# EAGLE schematic Equalizer_VUMeter (EAGLE 9.6.2)
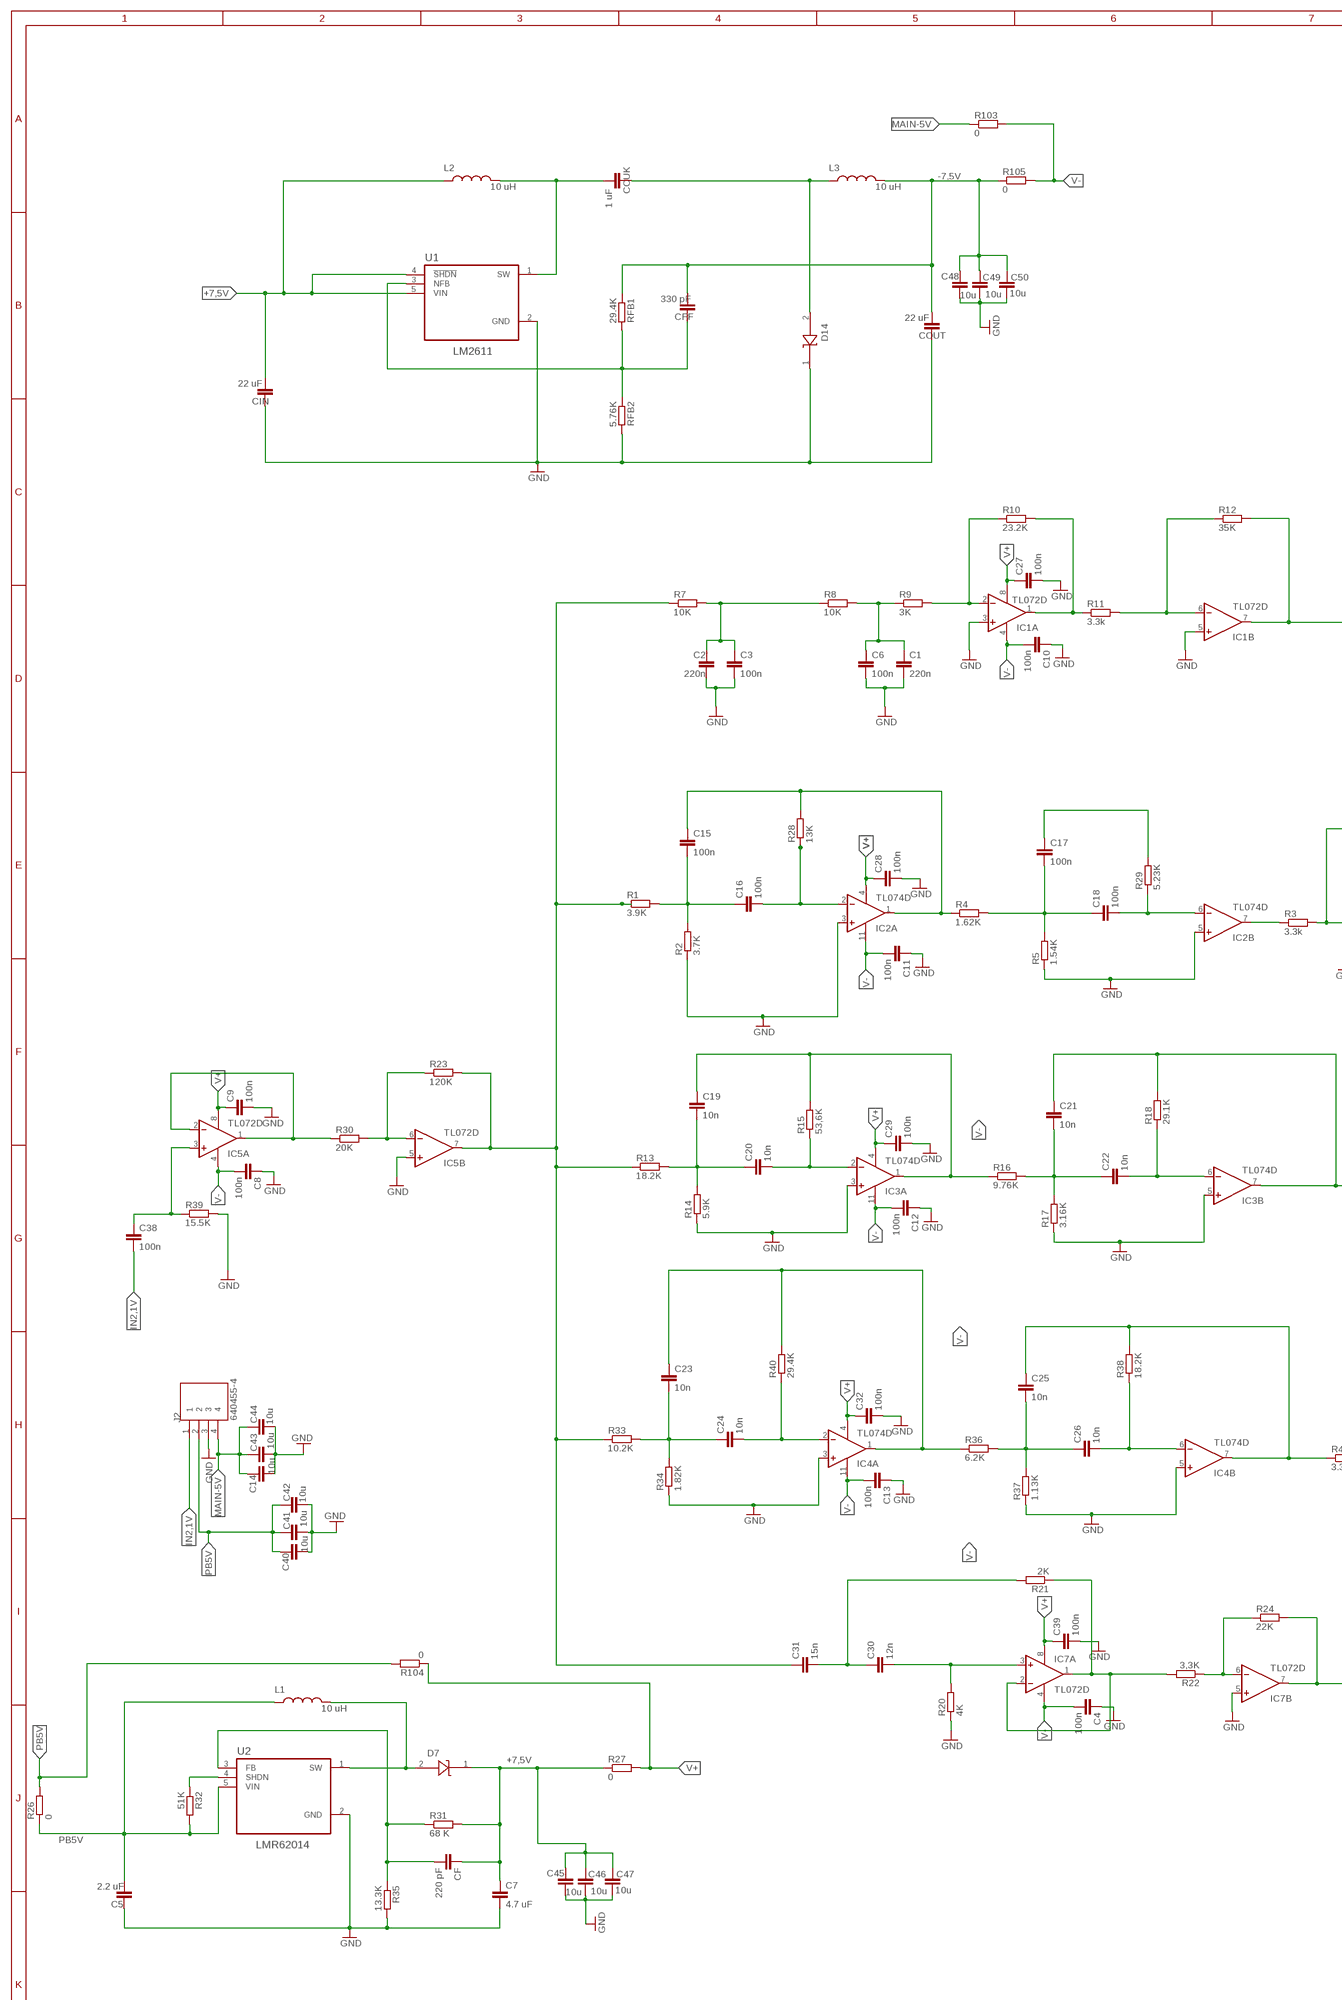
[diagram p0: schematic, sheet 1, part 1 of 3]
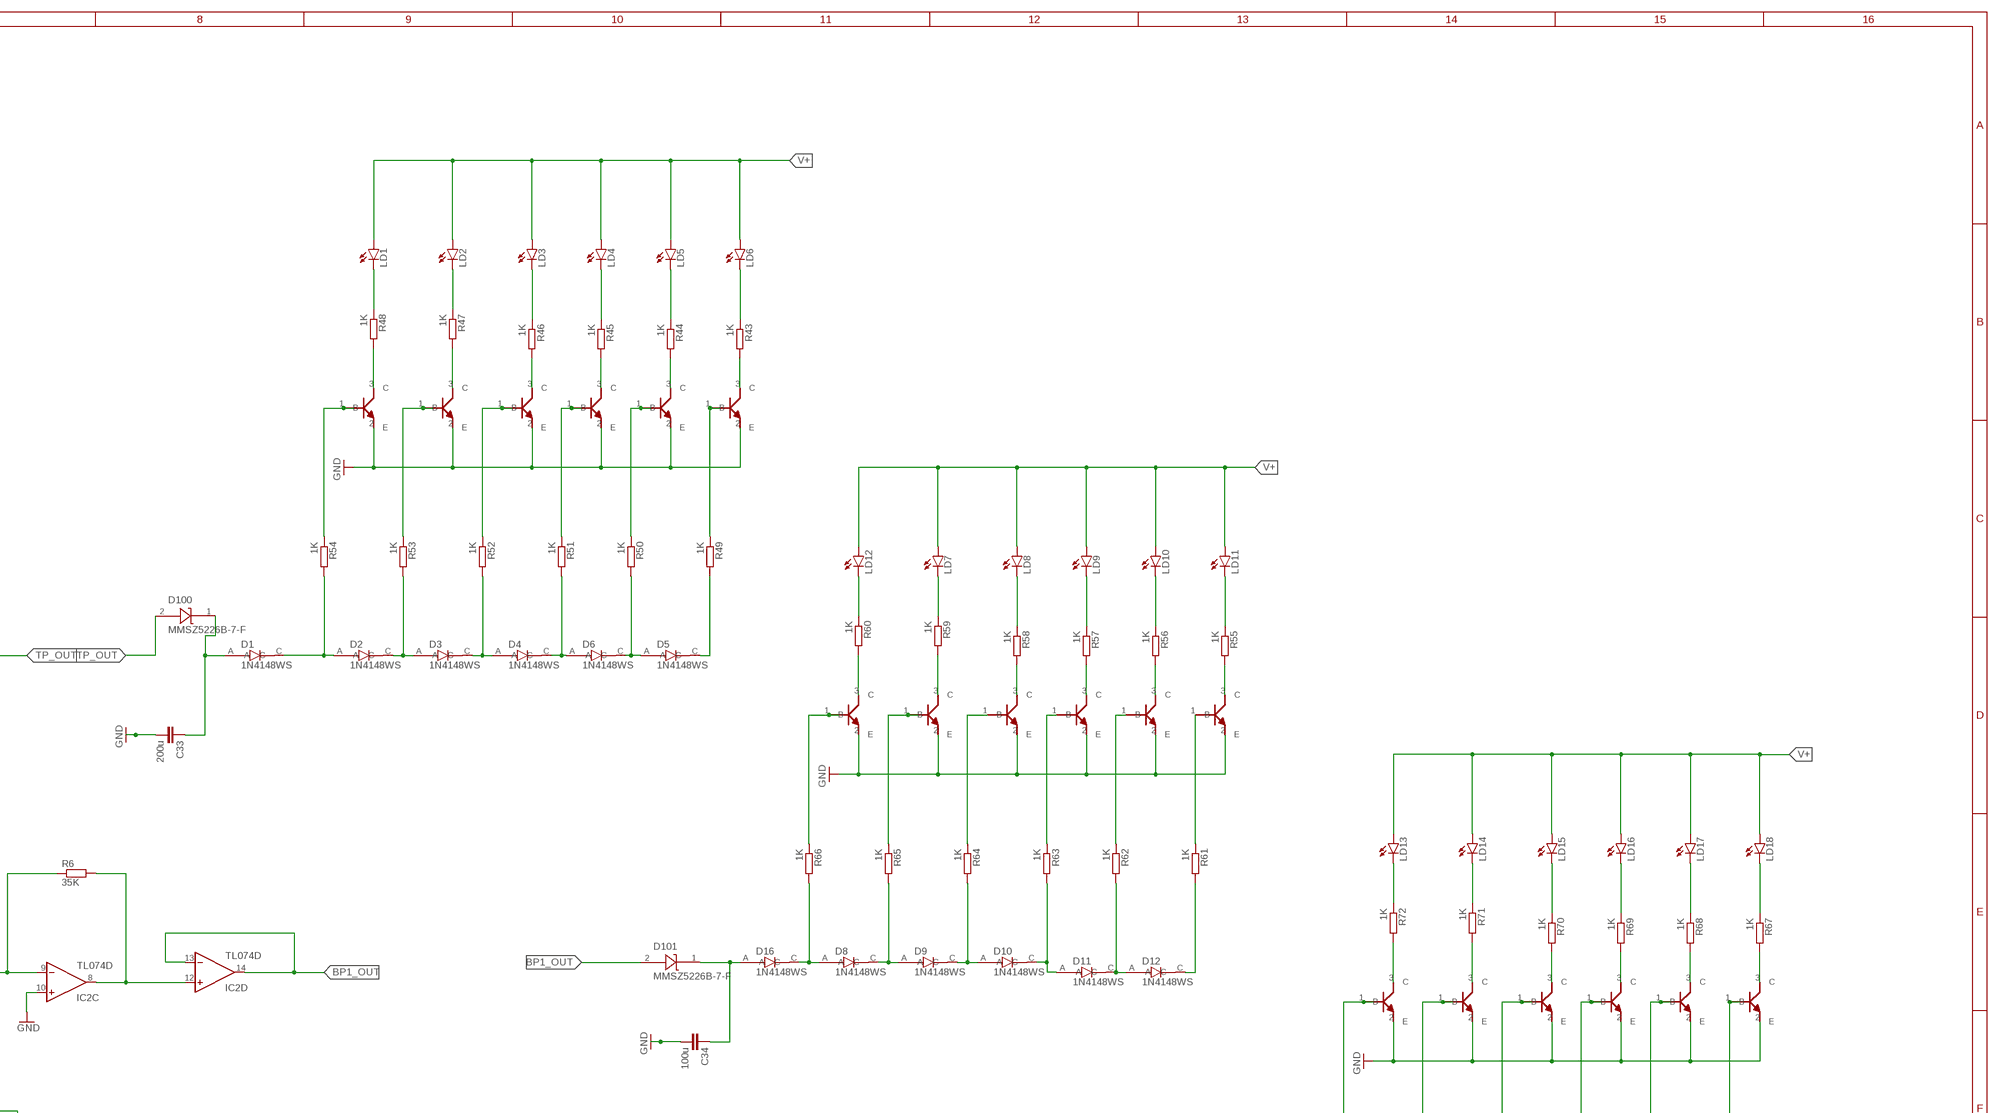
[diagram p1: schematic, sheet 1, part 2 of 3]
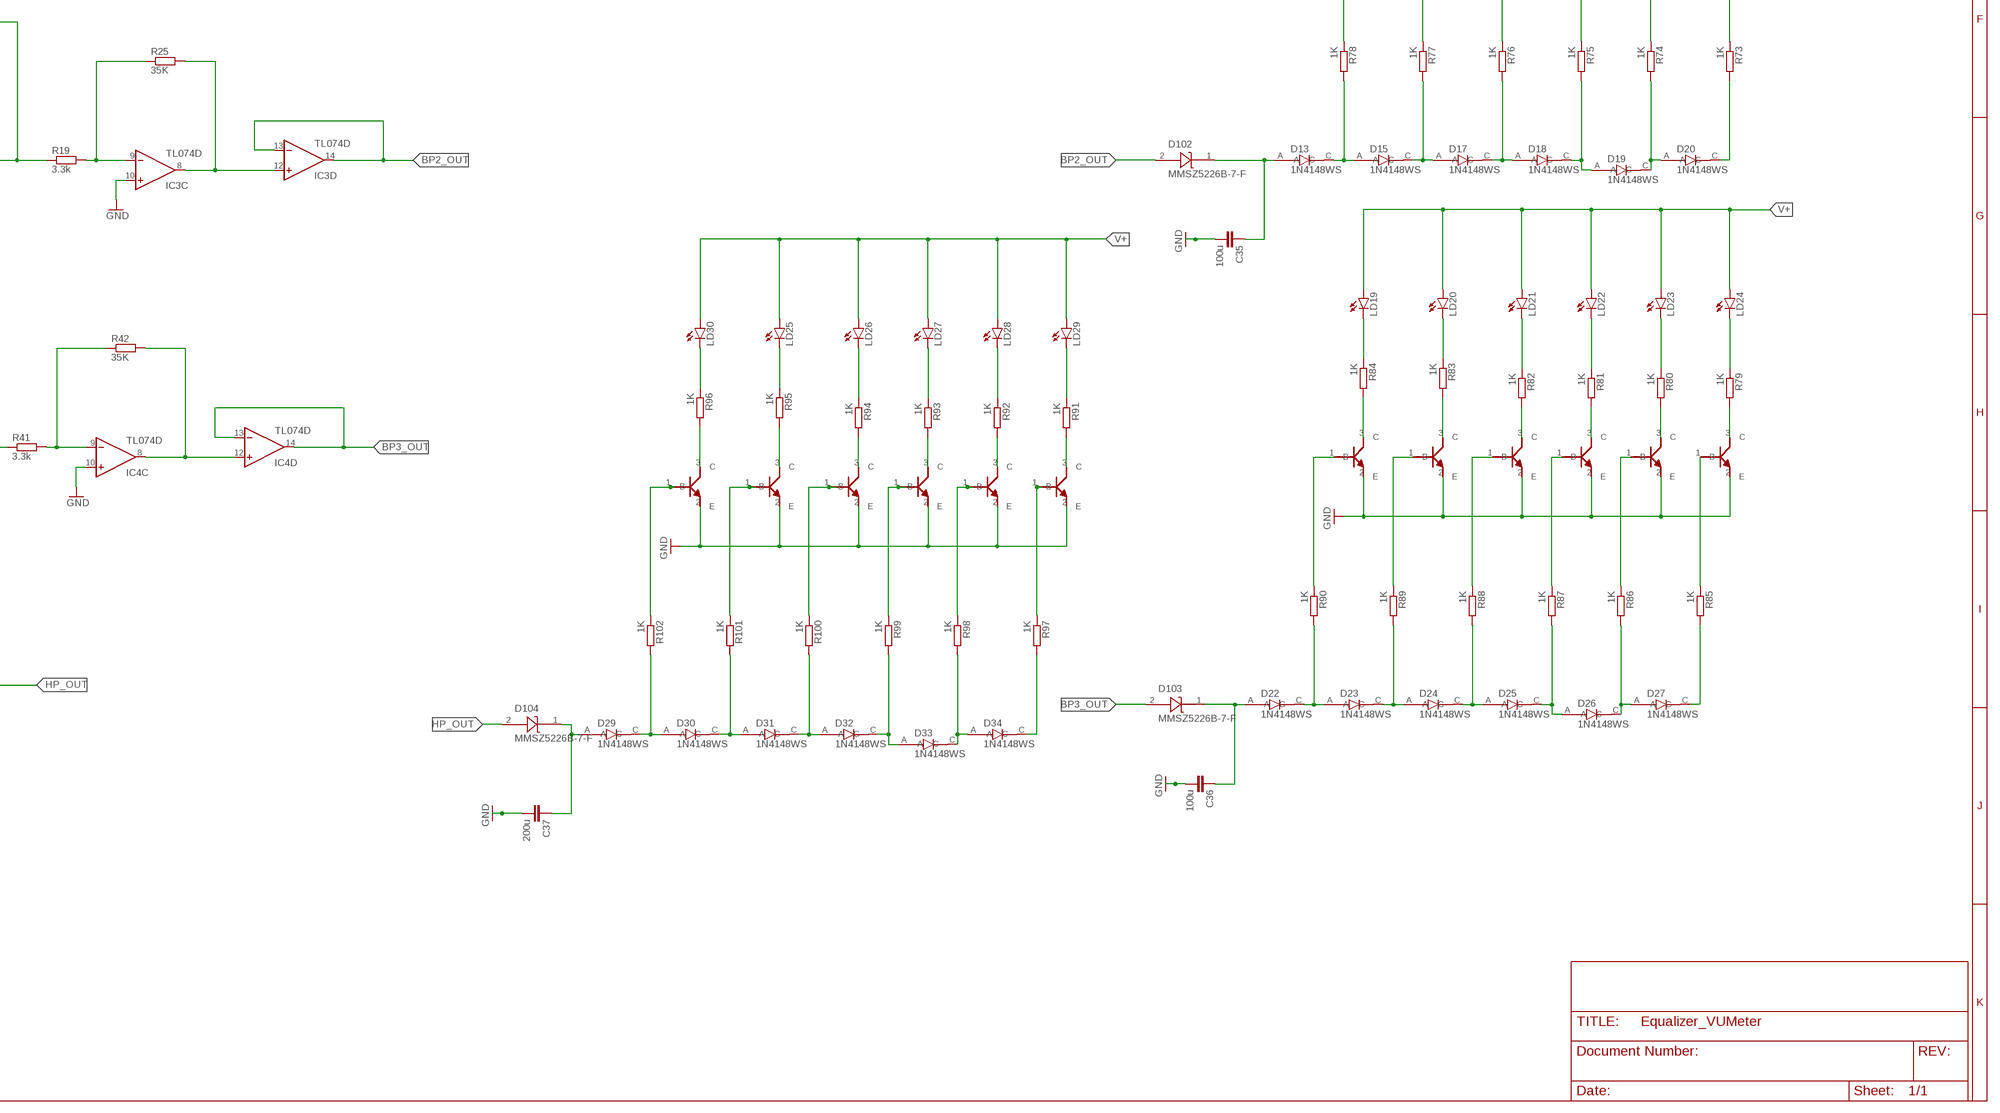
[diagram p2: schematic, sheet 1, part 3 of 3]

## Parts
C1  220n  C-EUC0603  [C0603]
C2  220n  C-EUC0603  [C0603]
C3  100n  C-EUC0603  [C0603]
C4  100n  C-EUC0603  [C0603]
C5  2.2 uF  C-EUC0603  [C0603]
C6  100n  C-EUC0603  [C0603]
C7  4.7 uF  C-EUC0603  [C0603]
C8  100n  C-EUC0603  [C0603]
C9  100n  C-EUC0603  [C0603]
C10  100n  C-EUC0603  [C0603]
C11  100n  C-EUC0603  [C0603]
C12  100n  C-EUC0603  [C0603]
C13  100n  C-EUC0603  [C0603]
C14  10u  C-EUC0603  [C0603]
C15  100n  C-EUC0603  [C0603]
C16  100n  C-EUC0603  [C0603]
C17  100n  C-EUC0603  [C0603]
C18  100n  C-EUC0603  [C0603]
C19  10n  C-EUC0603  [C0603]
C20  10n  C-EUC0603  [C0603]
C21  10n  C-EUC0603  [C0603]
C22  10n  C-EUC0603  [C0603]
C23  10n  C-EUC0603  [C0603]
C24  10n  C-EUC0603  [C0603]
C25  10n  C-EUC0603  [C0603]
C26  10n  C-EUC0603  [C0603]
C27  100n  C-EUC0603  [C0603]
C28  100n  C-EUC0603  [C0603]
C29  100n  C-EUC0603  [C0603]
C30  12n  C-EUC0603  [C0603]
C31  15n  C-EUC0603  [C0603]
C32  100n  C-EUC0603  [C0603]
C33  200u  C-EUC0603  [C0603]
C34  100u  C-EUC0603  [C0603]
C35  100u  C-EUC0603  [C0603]
C36  100u  C-EUC0603  [C0603]
C37  200u  C-EUC0603  [C0603]
C38  100n  C-EUC0603  [C0603]
C39  100n  C-EUC0603  [C0603]
C40  10u  C-EUC0603  [C0603]
C41  10u  C-EUC0603  [C0603]
C42  10u  C-EUC0603  [C0603]
C43  10u  C-EUC0603  [C0603]
C44  10u  C-EUC0603  [C0603]
C45  10u  C-EUC0603  [C0603]
C46  10u  C-EUC0603  [C0603]
C47  10u  C-EUC0603  [C0603]
C48  10u  C-EUC0603  [C0603]
C49  10u  C-EUC0603  [C0603]
C50  10u  C-EUC0603  [C0603]
CCUK  1 uF  C-EUC0603  [C0603]
CF  220 pF  C-EUC0603  [C0603]
CFF  330 pF  C-EUC0603  [C0603]
CIN  22 uF  C-EUC0603  [C0603]
COUT  22 uF  C-EUC0603  [C0603]
D1  1N4148WS  [SODFL2512X100N]
D2  1N4148WS  [SODFL2512X100N]
D3  1N4148WS  [SODFL2512X100N]
D4  1N4148WS  [SODFL2512X100N]
D5  1N4148WS  [SODFL2512X100N]
D6  1N4148WS  [SODFL2512X100N]
D7  MMSZ5226B-7-F  [SOD3715X135L32X57N]
D8  1N4148WS  [SODFL2512X100N]
D9  1N4148WS  [SODFL2512X100N]
D10  1N4148WS  [SODFL2512X100N]
D11  1N4148WS  [SODFL2512X100N]
D12  1N4148WS  [SODFL2512X100N]
D13  1N4148WS  [SODFL2512X100N]
D14  MMSZ5226B-7-F  [SOD3715X135L32X57N]
D15  1N4148WS  [SODFL2512X100N]
D16  1N4148WS  [SODFL2512X100N]
D17  1N4148WS  [SODFL2512X100N]
D18  1N4148WS  [SODFL2512X100N]
D19  1N4148WS  [SODFL2512X100N]
D20  1N4148WS  [SODFL2512X100N]
D22  1N4148WS  [SODFL2512X100N]
D23  1N4148WS  [SODFL2512X100N]
D24  1N4148WS  [SODFL2512X100N]
D25  1N4148WS  [SODFL2512X100N]
D26  1N4148WS  [SODFL2512X100N]
D27  1N4148WS  [SODFL2512X100N]
D29  1N4148WS  [SODFL2512X100N]
D30  1N4148WS  [SODFL2512X100N]
D31  1N4148WS  [SODFL2512X100N]
D32  1N4148WS  [SODFL2512X100N]
D33  1N4148WS  [SODFL2512X100N]
D34  1N4148WS  [SODFL2512X100N]
D100  MMSZ5226B-7-F  [SOD3715X135L32X57N]
D101  MMSZ5226B-7-F  [SOD3715X135L32X57N]
D102  MMSZ5226B-7-F  [SOD3715X135L32X57N]
D103  MMSZ5226B-7-F  [SOD3715X135L32X57N]
D104  MMSZ5226B-7-F  [SOD3715X135L32X57N]
IC1  TL072D  [SO08]
IC2  TL074D  [SO14]
IC3  TL074D  [SO14]
IC4  TL074D  [SO14]
IC5  TL072D  [SO08]
IC7  TL072D  [SO08]
J2  640455-4  [TE_640455-4]
L1  10 uH  ASMCI-0603-100M-T  [INDC1608X95N]
L2  10 uH  ASMCI-0603-100M-T  [INDC1608X95N]
L3  10 uH  ASMCI-0603-100M-T  [INDC1608X95N]
LD1  LEDCHIP-LED0603  [CHIP-LED0603]
LD2  LEDCHIP-LED0603  [CHIP-LED0603]
LD3  LEDCHIP-LED0603  [CHIP-LED0603]
LD4  LEDCHIP-LED0603  [CHIP-LED0603]
LD5  LEDCHIP-LED0603  [CHIP-LED0603]
LD6  LEDCHIP-LED0603  [CHIP-LED0603]
LD7  LEDCHIP-LED0603  [CHIP-LED0603]
LD8  LEDCHIP-LED0603  [CHIP-LED0603]
LD9  LEDCHIP-LED0603  [CHIP-LED0603]
LD10  LEDCHIP-LED0603  [CHIP-LED0603]
LD11  LEDCHIP-LED0603  [CHIP-LED0603]
LD12  LEDCHIP-LED0603  [CHIP-LED0603]
LD13  LEDCHIP-LED0603  [CHIP-LED0603]
LD14  LEDCHIP-LED0603  [CHIP-LED0603]
LD15  LEDCHIP-LED0603  [CHIP-LED0603]
LD16  LEDCHIP-LED0603  [CHIP-LED0603]
LD17  LEDCHIP-LED0603  [CHIP-LED0603]
LD18  LEDCHIP-LED0603  [CHIP-LED0603]
LD19  LEDCHIP-LED0603  [CHIP-LED0603]
LD20  LEDCHIP-LED0603  [CHIP-LED0603]
LD21  LEDCHIP-LED0603  [CHIP-LED0603]
LD22  LEDCHIP-LED0603  [CHIP-LED0603]
LD23  LEDCHIP-LED0603  [CHIP-LED0603]
LD24  LEDCHIP-LED0603  [CHIP-LED0603]
LD25  LEDCHIP-LED0603  [CHIP-LED0603]
LD26  LEDCHIP-LED0603  [CHIP-LED0603]
LD27  LEDCHIP-LED0603  [CHIP-LED0603]
LD28  LEDCHIP-LED0603  [CHIP-LED0603]
LD29  LEDCHIP-LED0603  [CHIP-LED0603]
LD30  LEDCHIP-LED0603  [CHIP-LED0603]
R1  3.9K  R-EU_R0603  [R0603]
R2  3.7K  R-EU_R0603  [R0603]
R3  3.3k  R-EU_R0603  [R0603]
R4  1.62K  R-EU_R0603  [R0603]
R5  1.54K  R-EU_R0603  [R0603]
R6  35K  R-EU_R0603  [R0603]
R7  10K  R-EU_R0603  [R0603]
R8  10K  R-EU_R0603  [R0603]
R9  3K  R-EU_R0603  [R0603]
R10  23.2K  R-EU_R0603  [R0603]
R11  3.3k  R-EU_R0603  [R0603]
R12  35K  R-EU_R0603  [R0603]
R13  18.2K  R-EU_R0603  [R0603]
R14  5.9K  R-EU_R0603  [R0603]
R15  53,6K  R-EU_R0603  [R0603]
R16  9.76K  R-EU_R0603  [R0603]
R17  3.16K  R-EU_R0603  [R0603]
R18  29.1K  R-EU_R0603  [R0603]
R19  3.3k  R-EU_R0603  [R0603]
R20  4K  R-EU_R0603  [R0603]
R21  2K  R-EU_R0603  [R0603]
R22  3,3K  R-EU_R0603  [R0603]
R23  120K  R-EU_R0603  [R0603]
R24  22K  R-EU_R0603  [R0603]
R25  35K  R-EU_R0603  [R0603]
R26  0  R-EU_R0603  [R0603]
R27  0  R-EU_R0603  [R0603]
R28  13K  R-EU_R0603  [R0603]
R29  5.23K  R-EU_R0603  [R0603]
R30  20K  R-EU_R0603  [R0603]
R31  68 K  R-EU_R0603  [R0603]
R32  51K  R-EU_R0603  [R0603]
R33  10.2K  R-EU_R0603  [R0603]
R34  1.82K  R-EU_R0603  [R0603]
R35  13.3K  R-EU_R0603  [R0603]
R36  6.2K  R-EU_R0603  [R0603]
R37  1.13K  R-EU_R0603  [R0603]
R38  18.2K  R-EU_R0603  [R0603]
R39  15.5K  R-EU_R0603  [R0603]
R40  29.4K  R-EU_R0603  [R0603]
R41  3.3k  R-EU_R0603  [R0603]
R42  35K  R-EU_R0603  [R0603]
R43  1K  R-EU_R0603  [R0603]
R44  1K  R-EU_R0603  [R0603]
R45  1K  R-EU_R0603  [R0603]
R46  1K  R-EU_R0603  [R0603]
R47  1K  R-EU_R0603  [R0603]
R48  1K  R-EU_R0603  [R0603]
R49  1K  R-EU_R0603  [R0603]
R50  1K  R-EU_R0603  [R0603]
R51  1K  R-EU_R0603  [R0603]
R52  1K  R-EU_R0603  [R0603]
R53  1K  R-EU_R0603  [R0603]
R54  1K  R-EU_R0603  [R0603]
R55  1K  R-EU_R0603  [R0603]
R56  1K  R-EU_R0603  [R0603]
R57  1K  R-EU_R0603  [R0603]
R58  1K  R-EU_R0603  [R0603]
R59  1K  R-EU_R0603  [R0603]
R60  1K  R-EU_R0603  [R0603]
R61  1K  R-EU_R0603  [R0603]
R62  1K  R-EU_R0603  [R0603]
R63  1K  R-EU_R0603  [R0603]
R64  1K  R-EU_R0603  [R0603]
R65  1K  R-EU_R0603  [R0603]
R66  1K  R-EU_R0603  [R0603]
R67  1K  R-EU_R0603  [R0603]
R68  1K  R-EU_R0603  [R0603]
R69  1K  R-EU_R0603  [R0603]
R70  1K  R-EU_R0603  [R0603]
R71  1K  R-EU_R0603  [R0603]
R72  1K  R-EU_R0603  [R0603]
R73  1K  R-EU_R0603  [R0603]
R74  1K  R-EU_R0603  [R0603]
R75  1K  R-EU_R0603  [R0603]
R76  1K  R-EU_R0603  [R0603]
R77  1K  R-EU_R0603  [R0603]
R78  1K  R-EU_R0603  [R0603]
R79  1K  R-EU_R0603  [R0603]
R80  1K  R-EU_R0603  [R0603]
R81  1K  R-EU_R0603  [R0603]
R82  1K  R-EU_R0603  [R0603]
R83  1K  R-EU_R0603  [R0603]
R84  1K  R-EU_R0603  [R0603]
R85  1K  R-EU_R0603  [R0603]
R86  1K  R-EU_R0603  [R0603]
R87  1K  R-EU_R0603  [R0603]
R88  1K  R-EU_R0603  [R0603]
R89  1K  R-EU_R0603  [R0603]
R90  1K  R-EU_R0603  [R0603]
R91  1K  R-EU_R0603  [R0603]
R92  1K  R-EU_R0603  [R0603]
R93  1K  R-EU_R0603  [R0603]
R94  1K  R-EU_R0603  [R0603]
R95  1K  R-EU_R0603  [R0603]
R96  1K  R-EU_R0603  [R0603]
R97  1K  R-EU_R0603  [R0603]
R98  1K  R-EU_R0603  [R0603]
R99  1K  R-EU_R0603  [R0603]
R100  1K  R-EU_R0603  [R0603]
R101  1K  R-EU_R0603  [R0603]
R102  1K  R-EU_R0603  [R0603]
R103  0  R-EU_R0603  [R0603]
R104  0  R-EU_R0603  [R0603]
R105  0  R-EU_R0603  [R0603]
RFB1  29.4K  R-EU_R0603  [R0603]
RFB2  5.76K  R-EU_R0603  [R0603]
T1  BC846A  [SOT23-3]
T2  BC846A  [SOT23-3]
T3  BC846A  [SOT23-3]
T4  BC846A  [SOT23-3]
T5  BC846A  [SOT23-3]
T6  BC846A  [SOT23-3]
T7  BC846A  [SOT23-3]
T8  BC846A  [SOT23-3]
T9  BC846A  [SOT23-3]
T10  BC846A  [SOT23-3]
T11  BC846A  [SOT23-3]
T12  BC846A  [SOT23-3]
T13  BC846A  [SOT23-3]
T14  BC846A  [SOT23-3]
T15  BC846A  [SOT23-3]
T16  BC846A  [SOT23-3]
T17  BC846A  [SOT23-3]
T18  BC846A  [SOT23-3]
T19  BC846A  [SOT23-3]
T20  BC846A  [SOT23-3]
T21  BC846A  [SOT23-3]
T22  BC846A  [SOT23-3]
T23  BC846A  [SOT23-3]
T24  BC846A  [SOT23-3]
T25  BC846A  [SOT23-3]
T26  BC846A  [SOT23-3]
T27  BC846A  [SOT23-3]
T28  BC846A  [SOT23-3]
T29  BC846A  [SOT23-3]
T30  BC846A  [SOT23-3]
U1  LM2611  LM2611BMFX/NOPB  [SOT95P280X145-5N]
U2  LMR62014  LMR62014XMF/NOPB  [SOT95P280X145-5N]

## Nets
+7,5V: C7.1 C45.2 C46.1 C47.1 CF.1 CIN.1 D7.1(C) L2.1 R27.1 R31.2 U1.4(!SHDN) U1.5(VIN)
-7,5V: C48.2 C49.1 C50.1 CFF.1 COUT.1 L3.2 R105.1 RFB1.1
BP1_OUT: D101.2(A) IC2.13(D:-IN) IC2.14(D:OUT)
BP2_OUT: D102.2(A) IC3.13(D:-IN) IC3.14(D:OUT)
BP3_OUT: D103.2(A) IC4.13(D:-IN) IC4.14(D:OUT)
GND: C1.2 C2.2 C3.2 C4.1 C5.2 C6.2 C7.2 C8.1 C9.2 C10.1 C11.1 C12.1 C13.1 C14.1 C27.2 C28.2 C29.2 C32.2 C33.2 C34.2 C35.2 C36.2 C37.2 C39.2 C40.1 C41.2 C42.2 C43.2 C44.2 C45.1 C46.2 C47.2 C48.1 C49.2 C50.2 CIN.2 COUT.2 D14.1(C) IC1.3(A:+IN) IC1.5(B:+IN) IC2.3(A:+IN) IC2.5(B:+IN) IC2.10(C:+IN) IC3.3(A:+IN) IC3.5(B:+IN) IC3.10(C:+IN) IC4.3(A:+IN) IC4.5(B:+IN) IC4.10(C:+IN) IC5.5(B:+IN) IC7.5(B:+IN) J2.3 R2.1 R5.1 R14.1 R17.1 R20.1 R34.1 R35.2 R37.1 R39.2 RFB2.2 T1.2(E) T2.2(E) T3.2(E) T4.2(E) T5.2(E) T6.2(E) T7.2(E) T8.2(E) T9.2(E) T10.2(E) T11.2(E) T12.2(E) T13.2(E) T14.2(E) T15.2(E) T16.2(E) T17.2(E) T18.2(E) T19.2(E) T20.2(E) T21.2(E) T22.2(E) T23.2(E) T24.2(E) T25.2(E) T26.2(E) T27.2(E) T28.2(E) T29.2(E) T30.2(E) U1.2(GND) U2.2(GND)
HP_OUT: D104.2(A) IC7.7(B:OUT) R24.2
IN2,1V: C38.2 J2.1
MAIN-5V: C14.2 C43.1 C44.1 J2.4 R103.1
N$2: C1.1 C6.1 R8.2 R9.1
N$3: IC1.2(A:-IN) R9.2 R10.1
N$4: C2.1 C3.1 R7.2 R8.1
N$5: C31.1 IC5.7(B:OUT) R1.1 R7.1 R13.1 R23.2 R33.1
N$7: IC2.9(C:-IN) R3.2 R6.1
N$8: IC1.1(A:OUT) R10.2 R11.1
N$9: IC3.9(C:-IN) R19.2 R25.1
N$10: IC1.6(B:-IN) R11.2 R12.1
N$11: C15.2 C16.1 R1.2 R2.2
N$12: C16.2 IC2.2(A:-IN) R28.1
N$13: C15.1 IC2.1(A:OUT) R4.1 R28.2
N$15: C19.2 C20.1 R13.2 R14.2
N$16: C17.1 R29.2
N$17: C18.2 IC2.6(B:-IN) R29.1
N$18: C21.1 IC3.7(B:OUT) R18.2 R19.1
N$19: C20.2 IC3.2(A:-IN) R15.1
N$20: C19.1 IC3.1(A:OUT) R15.2 R16.1
N$21: R32.1 U2.4(SHDN)
N$22: CF.2 R31.1 R35.1 U2.3(FB)
N$23: C21.2 C22.1 R16.2 R17.2
N$24: C22.2 IC3.6(B:-IN) R18.1
N$25: IC4.8(C:OUT) IC4.12(D:+IN) R42.2
N$26: C23.1 IC4.1(A:OUT) R36.1 R40.2
N$27: C23.2 C24.1 R33.2 R34.2
N$28: C24.2 IC4.2(A:-IN) R40.1
N$29: IC5.6(B:-IN) R23.1 R30.2
N$30: D15.C D17.A R77.2
N$31: C25.2 C26.1 R36.2 R37.2
N$32: C26.2 IC4.6(B:-IN) R38.1
N$33: D17.C D18.A R76.2
N$34: C30.2 IC7.3(A:+IN) R20.2
N$35: C17.2 C18.1 R4.2 R5.2
N$36: IC7.1(A:OUT) IC7.2(A:-IN) R21.1 R22.2
N$37: D23.C D24.A R89.2
N$38: C30.1 C31.2 R21.2
N$39: IC7.6(B:-IN) R22.1 R24.1
N$40: LD6.C R43.1
N$41: LD5.C R44.1
N$42: IC5.1(A:OUT) IC5.2(A:-IN) R30.1
N$43: LD4.C R45.1
N$44: LD3.C R46.1
N$45: LD2.C R47.1
N$46: LD1.C R48.1
N$47: C38.1 IC5.3(A:+IN) R39.1
N$48: C25.1 IC4.7(B:OUT) R38.2 R41.1
N$49: R43.2 T6.3(C)
N$50: R44.2 T5.3(C)
N$51: R45.2 T4.3(C)
N$52: R46.2 T3.3(C)
N$53: R47.2 T2.3(C)
N$54: R48.2 T1.3(C)
N$55: R49.1 T6.1(B)
N$56: R50.1 T5.1(B)
N$57: R51.1 T4.1(B)
N$58: R52.1 T3.1(B)
N$59: R53.1 T2.1(B)
N$60: R54.1 T1.1(B)
N$61: C33.1 D1.A D100.1(C)
N$62: D1.C D2.A R54.2
N$63: D2.C D3.A R53.2
N$64: D3.C D4.A R52.2
N$65: D4.C D6.A R51.2
N$66: D5.A D6.C R50.2
N$67: D5.C R49.2
N$68: LD11.C R55.1
N$69: LD10.C R56.1
N$70: LD9.C R57.1
N$71: LD8.C R58.1
N$72: LD7.C R59.1
N$73: LD12.C R60.1
N$74: D7.2(A) L1.2 U2.1(SW)
N$75: R55.2 T7.3(C)
N$76: R56.2 T8.3(C)
N$77: R57.2 T9.3(C)
N$78: R58.2 T10.3(C)
N$79: R59.2 T11.3(C)
N$80: R60.2 T12.3(C)
N$81: R61.1 T7.1(B)
N$82: R62.1 T8.1(B)
N$83: R63.1 T9.1(B)
N$84: R64.1 T10.1(B)
N$85: R65.1 T11.1(B)
N$86: R66.1 T12.1(B)
N$87: C34.1 D16.A D101.1(C)
N$88: D8.A D16.C R66.2
N$89: D8.C D9.A R65.2
N$90: D9.C D10.A R64.2
N$91: D10.C D11.A R63.2
N$92: D11.C D12.A R62.2
N$93: D12.C R61.2
N$94: LD18.C R67.1
N$95: LD17.C R68.1
N$96: LD16.C R69.1
N$97: LD15.C R70.1
N$98: LD14.C R71.1
N$99: LD13.C R72.1
N$100: IC3.8(C:OUT) IC3.12(D:+IN) R25.2
N$101: R67.2 T18.3(C)
N$102: R68.2 T17.3(C)
N$103: R69.2 T16.3(C)
N$104: R70.2 T15.3(C)
N$105: R71.2 T14.3(C)
N$106: R72.2 T13.3(C)
N$107: R73.1 T18.1(B)
N$108: R74.1 T17.1(B)
N$109: R75.1 T16.1(B)
N$110: R76.1 T15.1(B)
N$111: R77.1 T14.1(B)
N$112: R78.1 T13.1(B)
N$113: C35.1 D13.A D102.1(C)
N$114: D13.C D15.A R78.2
N$115: IC2.8(C:OUT) IC2.12(D:+IN) R6.2
N$117: D18.C D19.A R75.2
N$118: D19.C D20.A R74.2
N$119: D20.C R73.2
N$120: LD24.C R79.1
N$121: LD23.C R80.1
N$122: LD22.C R81.1
N$123: LD21.C R82.1
N$124: LD20.C R83.1
N$125: LD19.C R84.1
N$126: CCUK.2 D14.2(A) L3.1
N$127: R79.2 T24.3(C)
N$128: R80.2 T23.3(C)
N$129: R81.2 T22.3(C)
N$130: R82.2 T21.3(C)
N$131: R83.2 T20.3(C)
N$132: R84.2 T19.3(C)
N$133: R85.1 T24.1(B)
N$134: R86.1 T23.1(B)
N$135: R87.1 T22.1(B)
N$136: R88.1 T21.1(B)
N$137: R89.1 T20.1(B)
N$138: R90.1 T19.1(B)
N$139: C36.1 D22.A D103.1(C)
N$140: D22.C D23.A R90.2
N$141: CCUK.1 L2.2 U1.1(SW)
N$142: D24.C D25.A R88.2
N$143: D25.C D26.A R87.2
N$144: D26.C D27.A R86.2
N$145: D27.C R85.2
N$146: LD29.C R91.1
N$147: LD28.C R92.1
N$148: LD27.C R93.1
N$149: LD26.C R94.1
N$150: LD25.C R95.1
N$151: LD30.C R96.1
N$152: CFF.2 RFB1.2 RFB2.1 U1.3(NFB)
N$153: R91.2 T30.3(C)
N$154: R92.2 T29.3(C)
N$155: R93.2 T28.3(C)
N$156: R94.2 T27.3(C)
N$157: R95.2 T26.3(C)
N$158: R96.2 T25.3(C)
N$159: R97.1 T30.1(B)
N$160: R98.1 T29.1(B)
N$161: R99.1 T28.1(B)
N$162: R100.1 T27.1(B)
N$163: R101.1 T26.1(B)
N$164: R102.1 T25.1(B)
N$165: C37.1 D29.A D104.1(C)
N$166: D29.C D30.A R102.2
N$167: D30.C D31.A R101.2
N$168: D31.C D32.A R100.2
N$169: D32.C D33.A R99.2
N$170: D33.C D34.A R98.2
N$171: D34.C R97.2
N$181: IC2.7(B:OUT) R3.1
N$183: IC4.9(C:-IN) R41.2 R42.1
PB5V: C5.1 C40.2 C41.1 C42.1 J2.2 L1.1 R26.1 R26.2 R32.2 R104.2 U2.5(VIN)
TP_OUT: D100.2(A) IC1.7(B:OUT) R12.2
V+: C9.1 C27.1 C28.1 C29.1 C32.1 C39.1 IC1.8(P:V+) IC2.4(P:V+) IC3.4(P:V+) IC4.4(P:V+) IC5.8(P:V+) IC7.8(P:V+) LD1.A LD2.A LD3.A LD4.A LD5.A LD6.A LD7.A LD8.A LD9.A LD10.A LD11.A LD12.A LD13.A LD14.A LD15.A LD16.A LD17.A LD18.A LD19.A LD20.A LD21.A LD22.A LD23.A LD24.A LD25.A LD26.A LD27.A LD28.A LD29.A LD30.A R27.2 R104.1
V-: C4.2 C8.2 C10.2 C11.2 C12.2 C13.2 IC1.4(P:V-) IC2.11(P:V-) IC3.11(P:V-) IC4.11(P:V-) IC5.4(P:V-) IC7.4(P:V-) R103.2 R105.2

## Library data of the parts
C1-C4 C6 C8-C37 C39-C50 = rcl:C-EU: CAPACITOR, European symbol
C5 C7 C38 CCUK CF CFF CIN COUT = rcl:C-EU: CAPACITOR, European symbol; SPICEPREFIX: C
D1-D6 D8-D13 D15-D20 D22-D27 D29-D34 = 1N4148WS:1N4148WS: 1N4148WS Series 75 V 300 mA Surface Mount Small Signal Diodes - SOD-323F Check prices <https://pricing.snapeda.com/parts/1N4148WS/ON%20Semiconductor/view-part?ref=eda>; AVAILABILITY: Good; DESCRIPTION: Diode Standard 75V 150mA Surface Mount SOD-323F; MF: ON Semiconductor; MP: 1N4148WS; PACKAGE: SOD-323FL-2 ON Semiconductor; PRICE: None; PURCHASE-URL: https://pricing.snapeda.com/search/part/1N4148WS/?ref=eda
D7 D14 D100-D104 = MMSZ5226B-7-F:MMSZ5226B-7-F: Diode Zener Single 3.3V 5% 500mW Automotive 2-Pin SOD-123 T/R Check prices <https://pricing.snapeda.com/parts/MMSZ5226B-7-F/Diodes%20Inc./view-part?ref=eda>; AVAILABILITY: Good; DESCRIPTION: Zener Diode 3.3V 500mW ±5% Surface Mount SOD-123; MF: Diodes Inc.; MP: MMSZ5226B-7-F; PACKAGE: SOD-123 Diodes Inc.; PRICE: None; PURCHASE-URL: https://pricing.snapeda.com/search/part/MMSZ5226B-7-F/?ref=eda
IC1 IC5 IC7 = linear:TL072: OP AMP
IC2-IC4 = linear:TL074: OP AMP
J2 = 640455-4:640455-4: Check prices <https://pricing.snapeda.com/parts/640455-4/TE%20Connectivity/view-part?ref=eda>; AVAILABILITY: In Stock; CENTERLINE_PITCH: 2.54 mm[.1 in]; COMMENT: 640455-4; DESCRIPTION: Headers & Receptacles cable a placa 8 POS MONO SHAPE MKII TAB ASS'Y GW 750.N TYCO / TE CONNECTIVITY; MF: TE Connectivity; MP: 640455-4; NUMBER_OF_POSITIONS: 4; PACKAGE: None; PRICE: None; PRODUCT_TYPE: Connector; PURCHASE-URL: https://pricing.snapeda.com/search/part/640455-4/?ref=eda
L1-L3 = ASMCI-0603-100M-T:ASMCI-0603-100M-T: MULTILAYER CHIP POWER INDUCTOR, 10UH, 50MA, CERAMIC, ±20%, SHIELDED, 0.90 OHM, 20MHZ, 0603, SMD Check prices <https://pricing.snapeda.com/parts/ASMCI-0603-100M-T/Abracon%20LLC/view-part?ref=eda>; AVAILABILITY: Good; DESCRIPTION: 10µH Shielded Multilayer Inductor 50mA 900mOhm 0603 (1608 Metric); MF: Abracon LLC; MP: ASMCI-0603-100M-T; PACKAGE: 1608 Taiyo Yuden; PRICE: None; PURCHASE-URL: https://pricing.snapeda.com/search/part/ASMCI-0603-100M-T/?ref=eda
LD1-LD30 = led:LED: LED OSRAM: - CHIPLED LG R971, LG N971, LY N971, LG Q971, LY Q971, LO R971, LY R971 LH N974, LH R974 LS Q976, LO Q976, LY Q976 LO Q996 - Hyper CHIPLED LW Q18S LB Q993, LB Q99A, LB R99A - SideLED LS A670, LO A670, LY A670, LG A670, LP A670 LB A673, LV A673, LT A673, LW A673 LH A674 LY A675 LS A676, LA A676, LO A676, LY A676, LW A676 LS A679, LY A679, LG A679 - Hyper Micro SIDELED® LS Y876, LA Y876, LO Y876, LY Y876 LT Y87S - SmartLED LW L88C, LW L88S LB L89C, LB L89S, LG L890 LS L89K, LO L89K, LY L89K LS L896, LA L896, LO L896, LY L896 - TOPLED LS T670, LO T670, LY T670, LG T670, LP T670 LSG T670, LSP T670, LSY T670, LOP T670, LYG T670 LG T671, LOG T671, LSG T671 LB T673, LV T673, LT T673, LW T673 LH T674 LS T676, LA T676, LO T676, LY T676, LB T676, LH T676, LSB T676, LW T676 LB T67C, LV T67C, LT T67C, LS T67K, LO T67K, LY T67K, LW E67C LS E67B, LA E67B, LO E67B, LY E67B, LB E67C, LV E67C, LT E67C LW T67C LS T679, LY T679, LG T679 LS T770, LO T770, LY T770, LG T770, LP T770 LB T773, LV T773, LT T773, LW T773 LH T774 LS E675, LA E675, LY E675, LS T675 LS T776, LA T776, LO T776, LY T776, LB T776 LHGB T686 LT T68C, LB T68C - Hyper Mini TOPLED® LB M676 - Mini TOPLED Santana® LG M470 LS M47K, LO M47K, LY M47K Source: http://www.osram.convergy.de LUXEON: - LUMILED® LXK2-PW12-R00, LXK2-PW12-S00, LXK2-PW14-U00, LXK2-PW14-V00 LXK2-PM12-R00, LXK2-PM12-S00, LXK2-PM14-U00 LXK2-PE12-Q00, LXK2-PE12-R00, LXK2-PE12-S00, LXK2-PE14-T00, LXK2-PE14-U00 LXK2-PB12-K00, LXK2-PB12-L00, LXK2-PB12-M00, LXK2-PB14-N00, LXK2-PB14-P00, LXK2-PB14-Q00 LXK2-PR12-L00, LXK2-PR12-M00, LXK2-PR14-Q00, LXK2-PR14-R00 LXK2-PD12-Q00, LXK2-PD12-R00, LXK2-PD12-S00 LXK2-PH12-R00, LXK2-PH12-S00 LXK2-PL12-P00, LXK2-PL12-Q00, LXK2-PL12-R00 Source: www.luxeon.com KINGBRIGHT: KA-3528ASYC Source: www.kingbright.com
R1-R105 RFB1 RFB2 = rcl:R-EU_: RESISTOR, European symbol
T1-T9 T11-T30 = BC846A:BC846A; AVAILABILITY: Unavailable; DESCRIPTION: Bipolar (BJT) Transistor NPN 65V 100mA 100MHz 300mW Surface Mount SOT-23-3 (TO-236); MF: ON Semiconductor; MP: BC846A; PACKAGE: SOT-23-3 Motorola; PRICE: None
T10 = BC846A:BC846A; AVAILABILITY: Unavailable; DESCRIPTION: Bipolar (BJT) Transistor NPN 65V 100mA 100MHz 300mW Surface Mount SOT-23-3 (TO-236); MF: ON Semiconductor; MP: BC846A; PACKAGE: SOT-23-3 Motorola; PRICE: None; SPICEPREFIX: J
U1 = LM2611BMFX_NOPB:LM2611BMFX/NOPB: Check prices <https://pricing.snapeda.com/parts/LM2611BMFX/NOPB/Texas%20Instruments/view-part?ref=eda>; AVAILABILITY: Good; DESCRIPTION: 1.4MHz Cuk Converter 5-SOT-23 -40 to 125; MF: Texas Instruments; MP: LM2611BMFX/NOPB; PACKAGE: SOT-23-5 Texas Instruments; PRICE: None; PURCHASE-URL: https://pricing.snapeda.com/search/part/LM2611BMFX/NOPB/?ref=eda
U2 = LMR62014XMF_NOPB:LMR62014XMF/NOPB: Check prices <https://pricing.snapeda.com/parts/LMR62014XMF/NOPB/Texas%20Instruments/view-part?ref=eda>; AVAILABILITY: Good; DESCRIPTION: SIMPLE SWITCHER&reg; 2.7V to 14V, 1.4A Step-Up Regulator in SOT-23 Package 5-SOT-23 -40 to 125; MF: Texas Instruments; MP: LMR62014XMF/NOPB; PACKAGE: SOT-23-5 Texas Instruments; PRICE: None; PURCHASE-URL: https://pricing.snapeda.com/search/part/LMR62014XMF/NOPB/?ref=eda

## Net classes
0 default: width 0.003 mm, drill 0.1 mm